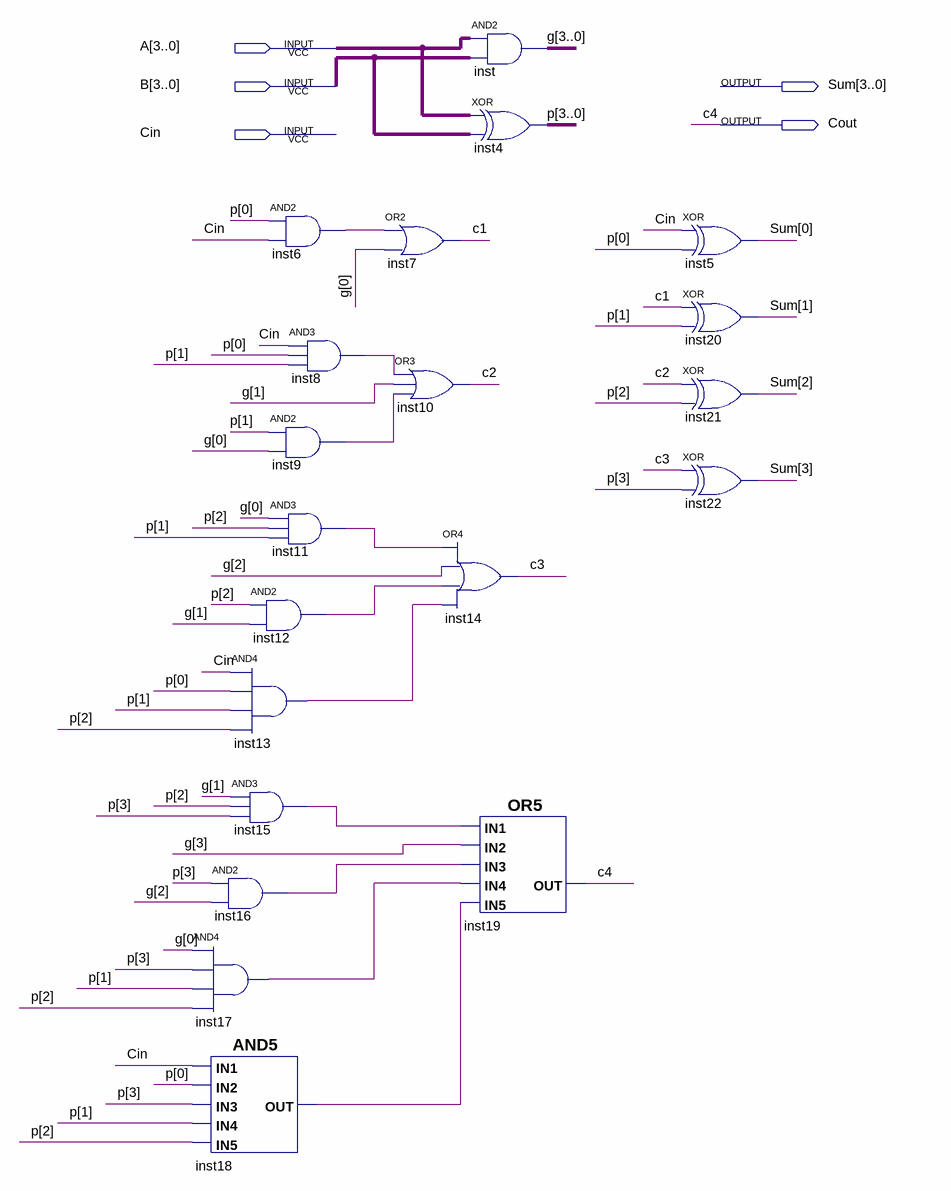
[diagram p0: schematic sheet]
// Quartus schematic ClaFourBitAdder.bdf as structural Verilog: 20 symbols, 5 pins
module ClaFourBitAdder (
  input  [3:0] A,
  input  [3:0] B,
  input  Cin,
  output [3:0] Sum,
  output Cout
);

  wire c1, c2, c3, inst6_out, inst8_out, inst9_out, inst11_out, inst12_out, inst13_out, inst15_out,
       inst16_out, inst17_out, inst18_out;
  wire [3:0] g, p;

  and inst16 (inst16_out, p[3], g[2]);
  and inst17 (inst17_out, g[0], p[3], p[1], p[2]);
  and inst18 (inst18_out, Cin, p[0], p[3], p[1], p[2]);
  and inst6 (inst6_out, p[0], Cin);
  and inst8 (inst8_out, Cin, p[0], p[1]);
  and inst9 (inst9_out, p[1], g[0]);
  and inst11 (inst11_out, g[0], p[2], p[1]);
  and inst12 (inst12_out, p[2], g[1]);
  and inst13 (inst13_out, Cin, p[0], p[1], p[2]);
  and inst15 (inst15_out, g[1], p[2], p[3]);
  or inst7 (c1, inst6_out, g[0]);
  or inst10 (c2, inst8_out, g[1], inst9_out);
  or inst14 (c3, inst11_out, g[2], inst12_out, inst13_out);
  assign g = A & B;  // AND2 inst, 4 bits wide
  assign p = A ^ B;  // XOR inst4, 4 bits wide
  or inst19 (Cout, inst15_out, g[3], inst16_out, inst17_out, inst18_out);
  xor inst5 (Sum[0], Cin, p[0]);
  xor inst20 (Sum[1], c1, p[1]);
  xor inst21 (Sum[2], c2, p[2]);
  xor inst22 (Sum[3], c3, p[3]);

  // Other names for the same wires on the sheet: c4 = Cout
endmodule
